# Altium project SoldeerStation.PrjPcb
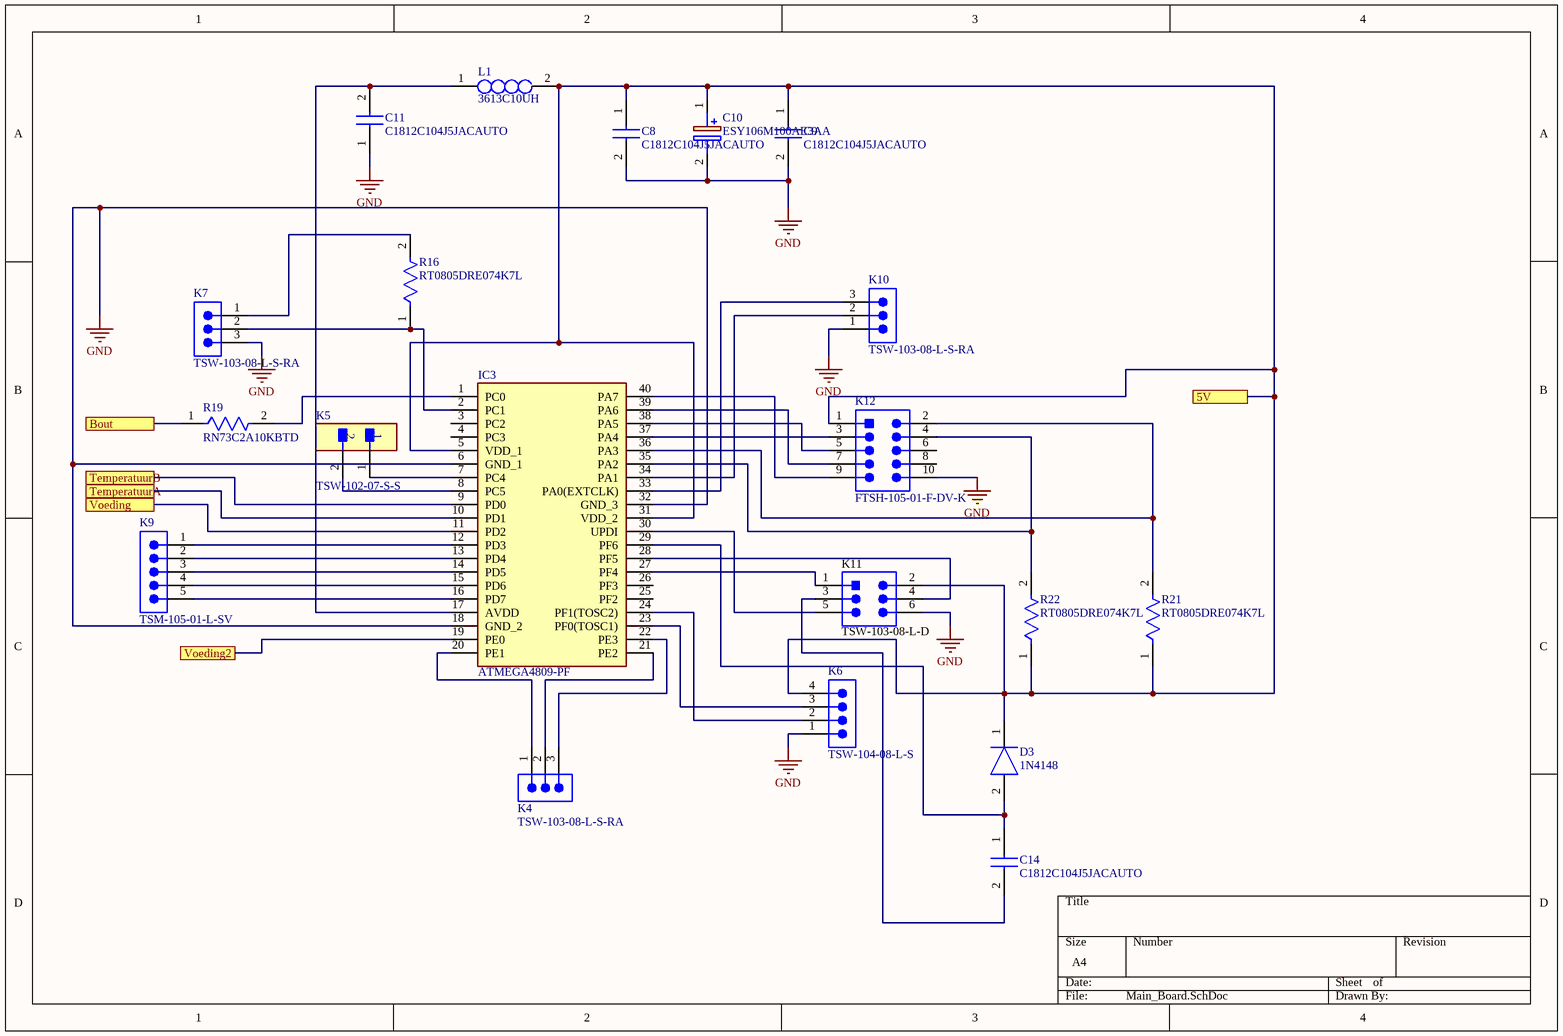
[diagram p0: Main_Board.SchDoc]
4 sheets, 76 parts. Net scope: flat (ports and power ports of the same name join across sheets).
Board file: PCBSoldeerStation.PcbDoc
Sheets:
  Main_Board.SchDoc
  Display.SchDoc
  Sturing_Temperatuur_Bout.SchDoc
  Voeding.SchDoc

## Sheet Main_Board.SchDoc
size A4; SheetNumber: 1; SheetTotal: 4

### Parts
C8  C1812C104J5JACAUTO  [CAPC4532X110N]
C9  C1812C104J5JACAUTO  [CAPC4532X110N]
C10  ESY106M100AE3AA  [CAPPRD250W50D630H1250]
C11  C1812C104J5JACAUTO  [CAPC4532X110N]
C14  C1812C104J5JACAUTO  [CAPC4532X110N]
D3  1N4148  [DIOAD1165W56L425D185]
IC3  ATMEGA4809-PF  [DIP1543W58P254L5175H635Q40N]
K4  TSW-103-08-L-S-RA  [SMTC-TSW-103-08-X-S-RA]
K5  TSW-102-07-S-S  [FP-TSW-102-07-S-S-MFG]
K6  TSW-104-08-L-S  [SMTC-TSW-104-08-X-S]
K7  TSW-103-08-L-S-RA  [SMTC-TSW-103-08-X-S-RA]
K9  TSM-105-01-L-SV  [SMTC-TSM-105-01-X-SV]
K10  TSW-103-08-L-S-RA  [SMTC-TSW-103-08-X-S-RA]
K11  TSW-103-08-L-D  [SMTC-TSW-103-08-L-D_V]
K12  FTSH-105-01-F-DV-K  [SMTC-FTSH-105-01-L-DV-K_V]
L1  3613C10UH  [INDM4532X340N]
R16  RT0805DRE074K7L  [FP-RT0805-MFG]
R19  RN73C2A10KBTD  [FP-RN732A-MFG]
R21  RT0805DRE074K7L  [FP-RT0805-MFG]
R22  RT0805DRE074K7L  [FP-RT0805-MFG]

### Ports
5V, Bout, TemperatuurA, TemperatuurB, Voeding, Voeding2

### Nets
GND: C8.2 C9.2 C10.2(-) C11.1 IC3.6(GND_1) IC3.18(GND_2) IC3.32(GND_3) K6.1 K7.3 K10.1 K11.6 K12.10
NetC2_1: C8.1 C9.1 C10.1(+) D3.1(K) IC3.5(VDD_1) IC3.31(VDD_2) K6.4 K11.2 K12.1 L1.2 R21.1 R22.1 ; port 5V
NetC6_1: IC3.9(PD0) ; port TemperatuurB
NetC11_2: C11.2 IC3.17(AVDD) L1.1
NetC12_2: IC3.10(PD1) ; port TemperatuurA
NetC14_1: C14.1 D3.2(A) IC3.29(PF6)
NetC14_2: C14.2 K11.3
NetD2_1: IC3.11(PD2) ; port Voeding
NetIC3_1: IC3.1(PC0) R19.2
NetIC3_2: IC3.2(PC1) K7.2 R16.1
NetIC3_7: IC3.7(PC4) K5.1
NetIC3_8: IC3.8(PC5) K5.2
NetIC3_12: IC3.12(PD3) K9.1
NetIC3_13: IC3.13(PD4) K9.2
NetIC3_14: IC3.14(PD5) K9.3
NetIC3_15: IC3.15(PD6) K9.4
NetIC3_16: IC3.16(PD7) K9.5
NetIC3_19: IC3.19(PE0) ; port Voeding2
NetIC3_20: IC3.20(PE1) K4.1
NetIC3_21: IC3.21(PE2) K4.2
NetIC3_22: IC3.22(PE3) K4.3
NetIC3_23: IC3.23(PF0(TOSC1)) K6.3
NetIC3_24: IC3.24(PF1(TOSC2)) K6.2
NetIC3_27: IC3.27(PF4) K11.1
NetIC3_28: IC3.28(PF5) K11.4
NetIC3_30: IC3.30(UPDI) K11.5
NetIC3_33: IC3.33(PA0(EXTCLK)) K10.3
NetIC3_34: IC3.34(PA1) K10.2
NetIC3_35: IC3.35(PA2) K12.4 R22.2
NetIC3_36: IC3.36(PA3) K12.2 R21.2
NetIC3_37: IC3.37(PA4) K12.3
NetIC3_38: IC3.38(PA5) K12.5
NetIC3_39: IC3.39(PA6) K12.7
NetIC3_40: IC3.40(PA7) K12.9
NetK7_1: K7.1 R16.2
NetR19_1: R19.1 ; port Bout

Not connected (* = marked no-connect by the designer): IC3 3(PC2) 4(PC3) 25(PF2) 26(PF3); K12 6 8

### Library data of the parts
C8 C9 C11 C14 = C1812C104J5JACAUTO: Capacitor; Manufacturer_Name: Kemet; Datasheet Link: https://www.mouser.co.uk/ProductDetail/KEMET/C1812C104J5JACAUTO?qs=sGAEpiMZZMuMW9TJLBQkXk76meUxNvf1WfCyyeF%2F6yU%3D; Height: 1.1mm; Manufacturer_Part_Number: C1812C104J5JACAUTO
C10 = ESY106M100AE3AA: Capacitor Polarised; Manufacturer_Name: Kemet; Datasheet Link: https://connect.kemet.com:7667/gateway/IntelliData-ComponentDocumentation/1.0/download/specsheet/ESY106M100AE3AA; Height: 12.5mm; Manufacturer_Part_Number: ESY106M100AE3AA
D3 = 1N4148: Diode; Manufacturer_Name: Nexperia; Datasheet Link: https://datasheet.datasheetarchive.com/originals/distributors/Datasheets-112/DSAP0040891.pdf; Manufacturer_Part_Number: 1N4148
IC3 = ATMEGA4809-PF: Integrated Circuit; Manufacturer_Name: Microchip; Datasheet Link: https://componentsearchengine.com//ATMEGA4809-PF.pdf; Height: 6.35mm; Mouser2 Part Number: 556-ATMEGA4809-PF; Mouser2 Price/Stock: https://www.mouser.com/Search/Refine.aspx?Keyword=556-ATMEGA4809-PF; Manufacturer_Part_Number: ATMEGA4809-PF
K4 K7 K10 = CMP-1024-00343-1: 0.025" SQ Post Header, Through-hole, Right Angle, -55 to 125 degC, 2.54 mm Pitch, 3-Pin, Male, RoHS; Manufacturer: Samtec; Pitch: 2.54 mm; ComponentLink2Description: Datasheet; Temperature Range: -55 to 125 degC; ComponentLink1Description: Manufacturer URL; Mounting Technology: Through-hole; ComponentLink3URL: http://www.samtec.com/documents/webfiles/cpdf/TSW-XXX-XX-XXX-X-XX-XXX-MKT.pdf; DatasheetVersion: F-214; PackageDescription: .025[0.64] SQ. Post Terminal Strip Assembly; PackageVersion: DM, 8/1988; Orientation: Right Angle; PackageReference: TSW-103-08-X-S-RA; ComponentLink1URL: http://www.samtec.com; ComponentLink3Description: Package Specification; PartNumber: TSW-103-08-L-S-RA; RoHS: True; ComponentLink2URL: http://www.samtec.com/documents/webfiles/pdf/TSW_TH.PDF
K5 = CMP-1681-00004-5: CONN HEADER VERT 2POS 2.54MM; Gender: Male; Max Current Rating: 7.6A; Max Voltage Rating (AC): 550V; Number of Contacts: 2; Contact Material: Bronze; Max Operating Temperature: 125°C; Min Operating Temperature: -55°C; Packaging: Bulk; Contact Plating: Gold; Length: 5.08mm; Mount: Through Hole; REACH SVHC: No SVHC; Package Quantity: 1; Color: Black; Connector Type: Header; Contact Finish - Mating: GOLD; Contact Mating Length: 0.23inch; Contact Shape: Square; Contact Type: Male Pin; Depth: 2.54mm; Fastening Type: Pull; Flammability Rating: UL94 V-0; Housing Color: Black; Housing Material: Polyester; Insulation Color: Black; Insulation Material: PBT; Lead Free: Lead Free; Number of Positions: 2; Number of Rows: 1; Orientation: Straight; Pitch: 2.54mm; Radiation Hardening: No; RoHS Compliant: Yes; Series: TSW; Termination: Solder; Width: 2.54mm
K6 = CMP-1024-00358-1: 0.025" SQ Post Header, Through-hole, Vertical, -55 to 125 degC, 2.54 mm Pitch, 4-Pin, Male, RoHS; Manufacturer: Samtec; Pitch: 2.54 mm; PartNumber: TSW-104-08-L-S; RoHS: True; Temperature Range: -55 to 125 degC; PackageDescription: .025[0.64] SQ. Post Terminal Strip Assembly; Orientation: Vertical; ComponentLink2URL: http://www.samtec.com/documents/webfiles/pdf/TSW_TH.PDF; ComponentLink1Description: Manufacturer URL; ComponentLink2Description: Datasheet; PackageVersion: DM, 8/1988; ComponentLink3URL: http://www.samtec.com/documents/webfiles/cpdf/TSW-XXX-XX-XXX-X-XX-XXX-MKT.pdf; Mounting Technology: Through-hole; PackageReference: TSW-104-08-X-S; ComponentLink3Description: Package Specification; ComponentLink1URL: http://www.samtec.com; DatasheetVersion: F-214
K9 = CMP-1024-00241-1: 0.025" SQ Post Header, Surface Mount, Vertical, -55 to 125 degC, 2.54 mm Pitch, 5-Pin, Male, RoHS; Manufacturer: Samtec; Pitch: 2.54 mm; Temperature Range: -55 to 125 degC; ComponentLink3Description: Package Specification; ComponentLink1Description: Manufacturer URL; RoHS: True; PackageDescription: Single Row .100 SMT Assembly; PackageReference: TSM-105-01-X-SV; PartNumber: TSM-105-01-L-SV; ComponentLink1URL: http://www.samtec.com; ComponentLink2URL: http://www.samtec.com/documents/webfiles/pdf/TSM.PDF; Orientation: Vertical; PackageVersion: BP, 8/2002; ComponentLink3URL: http://www.samtec.com/documents/webfiles/cpdf/TSM-1XX-XX-XXX-SV-XX-XXX-XX-MKT.pdf; ComponentLink2Description: Datasheet; DatasheetVersion: F-214; Mounting Technology: Surface Mount
K11 = CMP-1024-00336-5: Male Header, Pitch 2.54 mm, 2 x 3 Position, Height 8.38 mm, Tail Length 5.08 mm, -55 to 125 degC, RoHS, Bulk; Manufacturer: Samtec; DatasheetVersion: 04/2012; ComponentLink3URL: http://suddendocs.samtec.com/prints/tsw-xxx-xx-x-x-xx-xxx-footprint.pdf; PackageReference: TSW-103-08-L-D; Mounting Technology: Through Hole; Min Operating Temperature: -55 degC; ComponentLink2Description: Datasheet; Lead Pitch: 2.54 mm; ComponentLink1Description: Manufacturer URL; Mount: Through Hole; ComponentLink1URL: http://www.samtec.com/; ComponentLink3Description: Package Specification; Max Operating Temperature: 125 degC; PackageDescription: Male Header, Pitch 2.54 mm, 2 x 3 Position, Height 8.38 mm, Tail Length 5.08 mm; ComponentLink2URL: https://datasheet.ciiva.com/25618/0900766b81154476-25618436.pdf; RoHSCompliant: true
K12 = CMP-2000-05352-1: Male Header, Pitch 1.27 mm, 2 x 5 Position, Height 6.12 mm, RoHS, Tube; Manufacturer: Samtec; Number of Positions: 10; Connector Type: Header,Shrouded; Number of Positions Loaded: All; Row Spacing: 0.050"(1.27mm); Fastening Type: -; Package Reference: FTSH-105-01-L-DV-K; Termination: Solder; Package URL: http://suddendocs.samtec.com/prints/ftsh-1xx-xx-xxx-dv-xxx-footprint.pdf; Number of Rows: 2; Contact Finish Thickness: 3µin(0.08µm); Contact Type: MalePin; Manufacturer URL: http://www.samtec.com/; Contact Mating Length: 0.120"(3.05mm); Pitch: 0.050"(1.27mm); Series: FTSH; Features: -; Contact Finish: Gold; Color: Black; Family: RectangularConnectors-Headers,MalePins; Datasheet URL: http://suddendocs.samtec.com/prints/ftsh-1xx-xx-xxx-dv-xxx-mkt.pdf; Package Description: Male Header, Pitch 1.27 mm, 2 x 5 Position, Height 5.97 mm, Tail Length 4.32 mm; Mounting Type: SurfaceMount; Datasheet Version: Rev. ET, 10/1995; Category: Connectors,Interconnects; Packaging: Tube
L1 = 3613C10UH: Inductor; Manufacturer_Name: TE Connectivity; Datasheet Link: https://www.mouser.mx/datasheet/2/418/NG_CD_1624094_BB1-686728.pdf; Height: 3.4mm; Manufacturer_Part_Number: 3613C10UH
R16 R21 R22 = CMP-03412-005354-1: RES SMD 4.7K OHM 0.5% 1/8W 0805; Manufacturer: Yageo; Value: 4.7KΩ; Power Rating: 0.125W; Tolerance: 0.01; Voltage Rating: 150V; Temperature Coefficient: 50 ppm/°C; Lead Free: Yes; Device Class L2: Resistors; ComponentLink2Description: Datasheet; RoHS: TRUE; Package: RT0805; Resistance: 4.7KΩ; Device Class L3: Chip SMD Resistors; Ipc Land Pattern Name: RESC200125X50; Category: Res; Octopart: https://octopart.com/rt0805dre074k7l-yageo-1242027; Temperature: -55°C to +155°C; Temperature Range High: +155°C; Digikey Description: RES SMD 4.7K OHM 0.5% 1/8W 0805; Series: RT; Height: 0.6mm; Footprint Url: http://www.yageo.com/exep/pages/download/literatures/PYu-R_Mount_10.pdf; Device Class L1: Passive Components; Temperature Range Low: -55°C; Composition: Thin Film; Manufacturer Part Number: RT0805DRE074K7L; ComponentLink2URL: http://www.yageo.com/documents/recent/PYu-RT_1-to-0.01_RoHS_L_9.pdf; Automotive: No
R19 = CMP-03211-006013-1: SMD Chip Resistor, Thin Film, 10KΩ, 100 V, 0805 [2012 Metric], 100 mW, 0.1%, RN73 Series; Manufacturer: TE Connectivity; Voltage Rating: 100V; Power Rating: 0.1W; Temperature Coefficient: 10ppm/°C; Value: 10KΩ; Lead Free: Yes; Temperature Range Low: -55°C; Temperature: -55°C to 155°C; RoHS: TRUE; Category: Res; Device Class L3: Chip SMD Resistors; Device Class L1: Passive Components; Resistance: 10KΩ; ComponentLink2URL: https://www.te.com/commerce/DocumentDelivery/DDEController?Action=showdoc&DocId=Data+Sheet%7F1773270%7FP%7Fpdf%7FEnglish%7FENG_DS_1773270_P.pdf%7F1676162-2; Device Class L2: Resistors; Ipc Land Pattern Name: RESC200125X55; Automotive: No; Temperature Range High: 155°C; Height: 0.65mm; octopart_url: https://octopart.com/rn73c2a10kbtd-te+connectivity-22737006; Package: RN732A; Composition: Thin Film; packaging: 5000 Reel; Series: RN73; Manufacturer Part Number: RN73C2A10KBTD; ComponentLink2Description: Datasheet; Octopart: https://octopart.com/rn73c2a10kbtd-te+connectivity-22737006; Tolerance: 0.1%

## Sheet Display.SchDoc
size A4; SheetNumber: 2; SheetTotal: 4
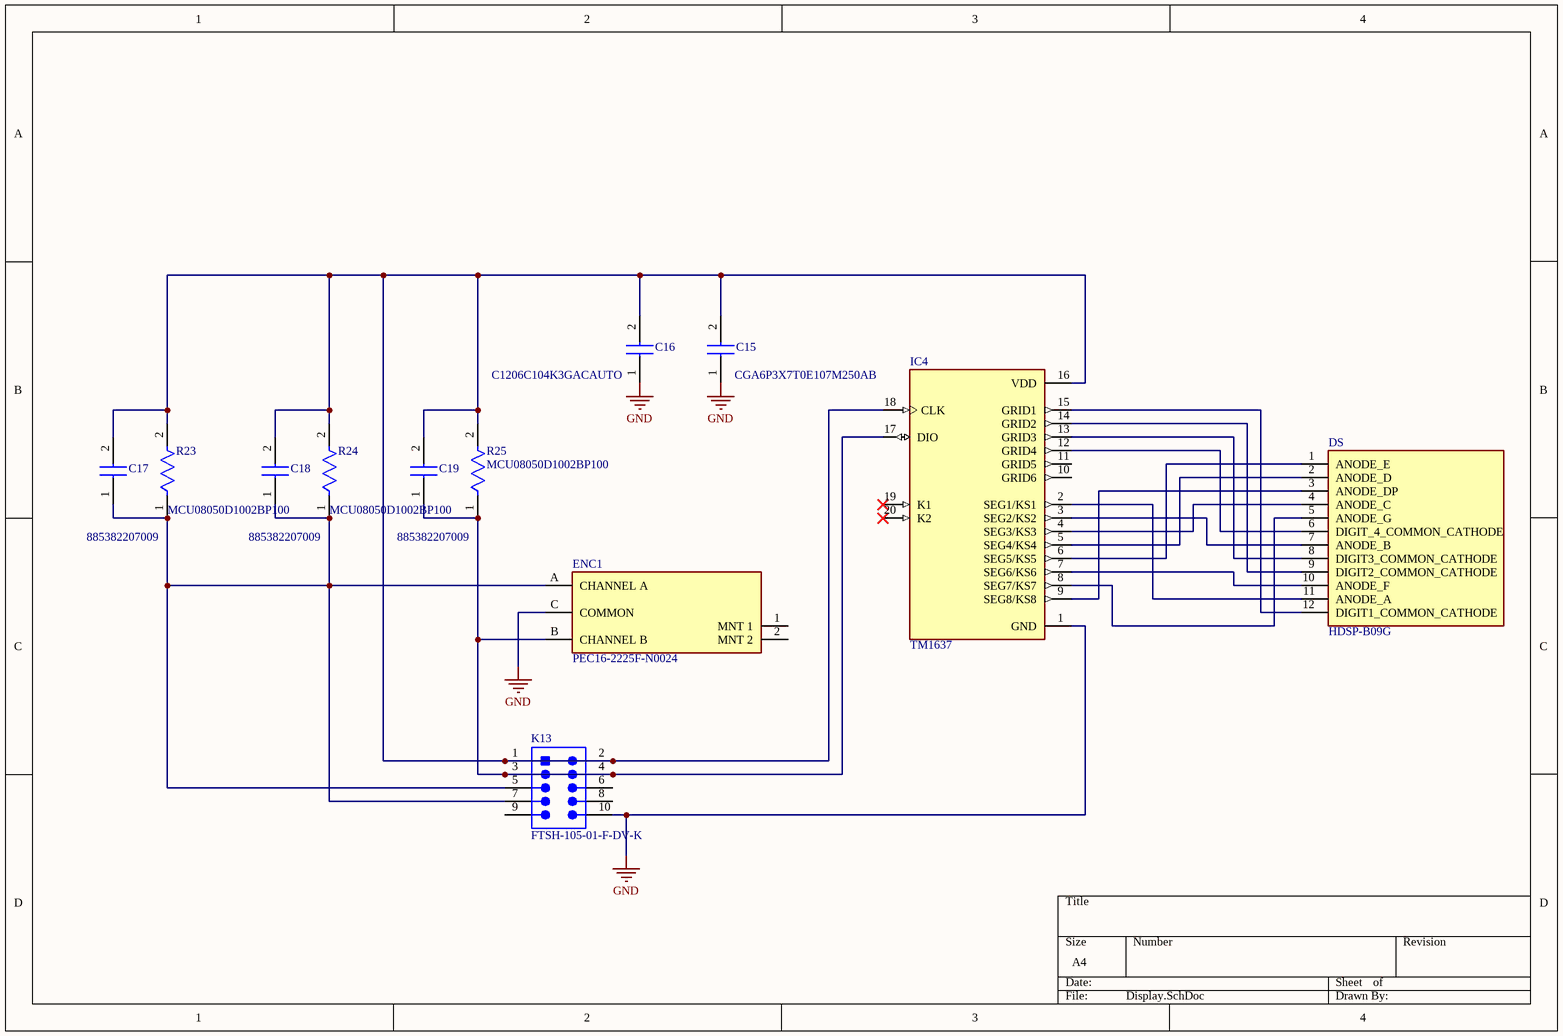
[diagram p1: Display.SchDoc]

### Parts
C15  CGA6P3X7T0E107M250AB  [CAPC3225X280N]
C16  C1206C104K3GACAUTO  [CAPC3216X180N]
C17  885382207009  [CAPC2012X135N]
C18  885382207009  [CAPC2012X135N]
C19  885382207009  [CAPC2012X135N]
DS  HDSP-B09G  [AVAGO_HDSP-B09G]
ENC1  PEC16-2225F-N0024  [FP-PEC16-2225F-N0024-MFG]
IC4  TM1637  [DIP778W43P254L2612H431Q20N]
K13  FTSH-105-01-F-DV-K  [SMTC-FTSH-105-01-L-DV-K_V]
R23  MCU08050D1002BP100  [FP-MCU0805-IPC_C]
R24  MCU08050D1002BP100  [FP-MCU0805-IPC_C]
R25  MCU08050D1002BP100  [FP-MCU0805-IPC_C]

### Nets
GND: C15.1 C16.1 ENC1.C(COMMON) IC4.1(GND) K13.10
NetC15_2: C15.2 C16.2 C17.2 C18.2 C19.2 IC4.16(VDD) IC4.18(CLK) K13.1 K13.2 R23.2 R24.2 R25.2
NetC17_1: C17.1 C18.1 ENC1.A(CHANNEL_A) K13.5 K13.7 R23.1 R24.1
NetC19_1: C19.1 ENC1.B(CHANNEL_B) IC4.17(DIO) K13.3 K13.4 R25.1
NetDS_1: DS.1(ANODE_E) IC4.6(SEG5/KS5)
NetDS_2: DS.2(ANODE_D) IC4.5(SEG4/KS4)
NetDS_3: DS.3(ANODE_DP) IC4.9(SEG8/KS8)
NetDS_4: DS.4(ANODE_C) IC4.4(SEG3/KS3)
NetDS_5: DS.5(ANODE_G) IC4.8(SEG7/KS7)
NetDS_6: DS.6(DIGIT_4_COMMON_CATHODE) IC4.12(GRID4)
NetDS_7: DS.7(ANODE_B) IC4.3(SEG2/KS2)
NetDS_8: DS.8(DIGIT3_COMMON_CATHODE) IC4.13(GRID3)
NetDS_9: DS.9(DIGIT2_COMMON_CATHODE) IC4.14(GRID2)
NetDS_10: DS.10(ANODE_F) IC4.7(SEG6/KS6)
NetDS_11: DS.11(ANODE_A) IC4.2(SEG1/KS1)
NetDS_12: DS.12(DIGIT1_COMMON_CATHODE) IC4.15(GRID1)

Not connected (* = marked no-connect by the designer): ENC1 1(MNT_1) 2(MNT_2); IC4 10(GRID6) 11(GRID5) 19(K1)* 20(K2)*; K13 6 8 9

### Library data of the parts
C15 = CGA6P3X7T0E107M250AB: Capacitor; Manufacturer_Name: TDK; Datasheet Link: https://product.tdk.com/system/files/dam/doc/product/capacitor/ceramic/mlcc/catalog/mlcc_automotive_general_en.pdf; Height: 2.8mm; Manufacturer_Part_Number: CGA6P3X7T0E107M250AB
C16 = C1206C104K3GACAUTO: Capacitor; Manufacturer_Name: Kemet; Datasheet Link: https://www.kemet.com/specsheet/C1206C104K3GACAUTO; Height: 1.8mm; Manufacturer_Part_Number: C1206C104K3GACAUTO
C17-C19 = 885382207009: Capacitor; Manufacturer_Name: Wurth Elektronik; Datasheet Link: https://katalog.we-online.com/pbs/datasheet/885382207009.pdf; Height: 1.35mm; Manufacturer_Part_Number: 885382207009
DS = HDSP-B09G: Display Modules - LED Character and Numeric Green 7-Segment Clock 4 Character Common Cathode 2.2V 20mA 0.752 H x 2.016 W x 0.315 D _19.10mm x 51.20mm x 8.00mm_ 12-DIP _0.600, 15.24mm_; MF: Broadcom Limited; Package: DIP-12 Broadcom; MP: HDSP-B09G; Value: *; Availability: Unavailable; SnapEDA_Link: https://www.snapeda.com/parts/HDSP-B09G/Broadcom%20Limited/view-part/1797524/?ref=snap; Price: None
ENC1 = CMP-07421-000055-1: ROTARY ENCODER MECHANICAL 24PPR; Operating Supply Voltage: 5V; Built in Switch: No; Output Type: Quadrature; Pulses per Revolution: 24; Number of Channels: 2; Detent: Yes; Min Operating Temperature: -30°C; Package Quantity: 50; Type: Mechanical; Number of Pins: 3; Packaging: Bulk; Max Operating Temperature: 70°C; Series: PEC16; Mount: Through Hole; Encoder Type: Mechanical; RoHS Compliant: Yes; Termination: PC Pin; Orientation: Right Angle
IC4 = TM1637: LED Drive Control Special Circuit; MF: Titan Micro Electronics; Package: Package; Availability: Not in stock; SnapEDA_Link: https://www.snapeda.com/parts/TM1637/Titan+Micro+Electronics/view-part/?ref=snap; MP: TM1637; Check_prices: https://www.snapeda.com/parts/TM1637/Titan+Micro+Electronics/view-part/?ref=eda; Value: *; Price: None
K13 = CMP-2000-05352-1: as K12 on sheet Main_Board; Fastening Type: -; Package Reference: FTSH-105-01-L-DV-K; Termination: Solder; Package URL: http://suddendocs.samtec.com/prints/ftsh-1xx-xx-xxx-dv-xxx-footprint.pdf; Number of Rows: 2; Contact Finish Thickness: 3µin(0.08µm); Contact Type: MalePin; Manufacturer URL: http://www.samtec.com/; Contact Mating Length: 0.120"(3.05mm); Pitch: 0.050"(1.27mm); Series: FTSH; Features: -; Contact Finish: Gold; Color: Black; Family: RectangularConnectors-Headers,MalePins; Datasheet URL: http://suddendocs.samtec.com/prints/ftsh-1xx-xx-xxx-dv-xxx-mkt.pdf; Package Description: Male Header, Pitch 1.27 mm, 2 x 5 Position, Height 5.97 mm, Tail Length 4.32 mm; Mounting Type: SurfaceMount; Datasheet Version: Rev. ET, 10/1995; Category: Connectors,Interconnects; Packaging: Tube
R23-R25 = CMP-02407-010458-1: RES 1.05K OHM 0.5% 1/5W 0805; Power Rating: 125mW; Voltage Rating (DC): 100V; Tolerance: 0.1%; Resistance: 10kR; Temperature Coefficient: 25ppm/°C; Min Operating Temperature: -55°C; Military Standard: Not; Composition: Thin Film; Max Power Dissipation: 125mW; Lead Free: Lead Free; Case/Package: 0805; Contact Plating: Tin; Depth: 1.25mm; Number of Terminations: 2; Height: 0.022inch; Package Quantity: 1000; Max Operating Temperature: 125°C; Packaging: Tape and Reel; Mount: Surface Mount; Radiation Hardening: No; Length: 2mm; Width: 0.049inch

## Sheet Sturing_Temperatuur_Bout.SchDoc
size A4; SheetNumber: 3; SheetTotal: 4
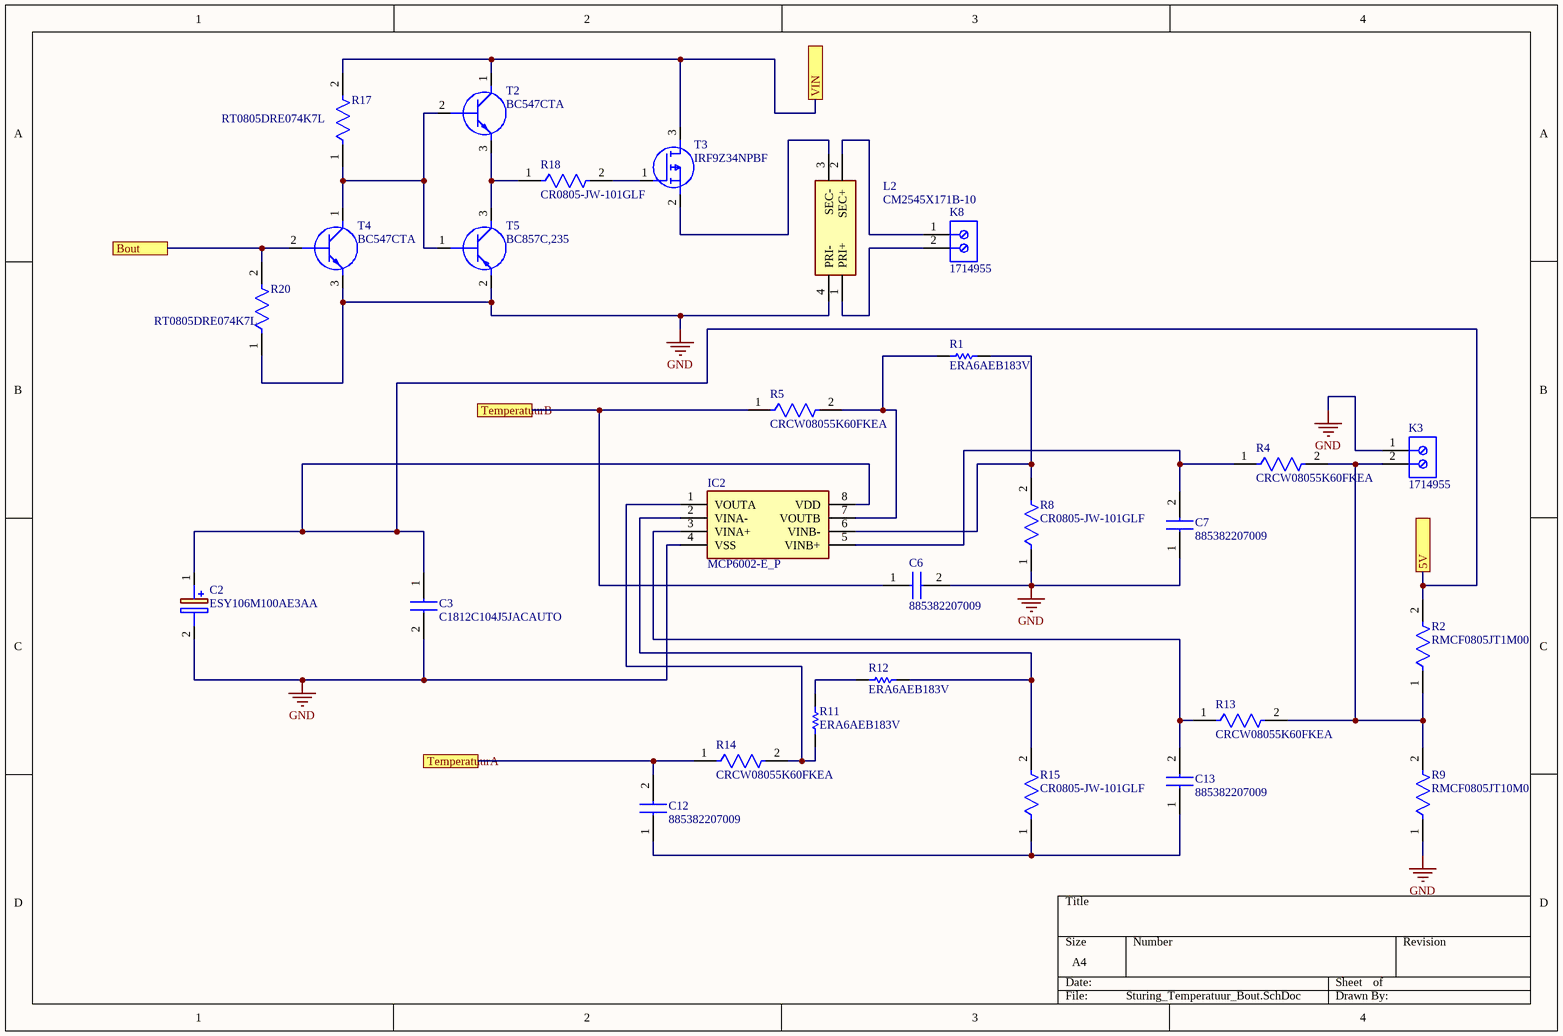
[diagram p2: Sturing_Temperatuur_Bout.SchDoc]

### Parts
C2  ESY106M100AE3AA  [CAPPRD250W50D630H1250]
C3  C1812C104J5JACAUTO  [CAPC4532X110N]
C6  885382207009  [CAPC2012X135N]
C7  885382207009  [CAPC2012X135N]
C12  885382207009  [CAPC2012X135N]
C13  885382207009  [CAPC2012X135N]
IC2  MCP6002-E_P  [DIP781W56P254L950H533Q8N]
K3  1714955  [PHOE-1714955_V]
K8  1714955  [PHOE-1714955_V]
L2  CM2545X171B-10  [CM2545X171B10]
R1  ERA6AEB183V  [RESC2013X60X40LL20T25]
R2  RMCF0805JT1M00  [FP-RMCF0805-IPC_C]
R4  CRCW08055K60FKEA  [FP-CRCW0805-e3-IPC_A]
R5  CRCW08055K60FKEA  [FP-CRCW0805-e3-IPC_A]
R8  CR0805-JW-101GLF  [FP-CR0805-IPC_A]
R9  RMCF0805JT10M0  [FP-RMCF0805-IPC_A]
R11  ERA6AEB183V  [RESC2013X60X40LL20T25]
R12  ERA6AEB183V  [RESC2013X60X40LL20T25]
R13  CRCW08055K60FKEA  [FP-CRCW0805-e3-IPC_A]
R14  CRCW08055K60FKEA  [FP-CRCW0805-e3-IPC_A]
R15  CR0805-JW-101GLF  [FP-CR0805-IPC_A]
R17  RT0805DRE074K7L  [FP-RT0805-MFG]
R18  CR0805-JW-101GLF  [FP-CR0805-IPC_A]
R20  RT0805DRE074K7L  [FP-RT0805-MFG]
T2  BC547CTA  [MC79L15ACPG]
T3  IRF9Z34NPBF  [TO254P469X1042X1967-3P]
T4  BC547CTA  [MC79L15ACPG]
T5  BC857C,235  [SOT95P230X110-3N]

### Ports
5V, Bout, TemperatuurA, TemperatuurB, VIN

### Nets
GND: C2.2(-) C3.2 C6.2 C7.1 IC2.4(VSS) K3.1 L2.4(PRI-) R8.1 R9.1 R20.1 T4.3(E) T5.2(E)
NetB1_1: R17.2 T2.1(C) T3.3(D) ; port VIN
NetC2_1: C2.1(+) C3.1 IC2.8(VDD) R2.2 ; port 5V
NetC6_1: C6.1 R5.1 ; port TemperatuurB
NetC7_2: C7.2 IC2.5(VINB+) R4.1
NetC12_1: C12.1 C13.1 R15.1
NetC12_2: C12.2 R14.1 ; port TemperatuurA
NetC13_2: C13.2 IC2.3(VINA+) R13.1
NetIC2_1: IC2.1(VOUTA) R11.1 R14.2
NetIC2_2: IC2.2(VINA-) R12.2 R15.2
NetIC2_6: IC2.6(VINB-) R1.2 R8.2
NetIC2_7: IC2.7(VOUTB) R1.1 R5.2
NetK3_2: K3.2 R2.1 R4.2 R9.2 R13.2
NetK8_1: K8.1 L2.2(SEC+)
NetK8_2: K8.2 L2.1(PRI+)
NetL2_3: L2.3(SEC-) T3.2(S)
NetR11_2: R11.2 R12.1
NetR17_1: R17.1 T2.2(B) T4.1(C) T5.1(B)
NetR18_1: R18.1 T2.3(E) T5.3(C)
NetR18_2: R18.2 T3.1(G)
NetR19_1: R20.2 T4.2(B) ; port Bout

### Library data of the parts
C2 = ESY106M100AE3AA: as C10 on sheet Main_Board; Datasheet Link: https://connect.kemet.com:7667/gateway/IntelliData-ComponentDocumentation/1.0/download/specsheet/ESY106M100AE3AA; Height: 12.5mm; Manufacturer_Part_Number: ESY106M100AE3AA
C3 = C1812C104J5JACAUTO: Capacitor; Manufacturer_Name: Kemet; Datasheet Link: https://www.mouser.co.uk/ProductDetail/KEMET/C1812C104J5JACAUTO?qs=sGAEpiMZZMuMW9TJLBQkXk76meUxNvf1WfCyyeF%2F6yU%3D; Height: 1.1mm; Manufacturer_Part_Number: C1812C104J5JACAUTO
C6 C7 C12 C13 = 885382207009: as C17 on sheet Display; Datasheet Link: https://katalog.we-online.com/pbs/datasheet/885382207009.pdf; Height: 1.35mm; Manufacturer_Part_Number: 885382207009
IC2 = MCP6002-E_P: Integrated Circuit; Manufacturer_Name: Microchip; Manufacturer_Part_Number: MCP6002-E/P; Datasheet Link: https://componentsearchengine.com//MCP6002-E_P.pdf; Height: 5.334mm; Mouser2 Part Number: 579-MCP6002-E/P; Mouser2 Price/Stock: https://www.mouser.com/Search/Refine.aspx?Keyword=579-MCP6002-E%2FP
K3 K8 = CMP-2000-05797-1: PC Terminal Block, Pitch 6.35 mm, 1 x 2 Position, Height 21.5 mm, Tail Lenght 5.1 mm, RoHS, Bulk; Manufacturer: Phoenix Contact; Package Description: PC Terminal Block, Pitch 6.35 mm, 1 x 2 Position, Height 21.5 mm, Tail Lenght 5.1 mm; Datasheet URL: http://media.digikey.com/pdf/Data%20Sheets/Phoenix%20Contact%20PDFs/1714955.pdf; Package Reference: 1714955; Manufacturer URL: http://www.phoenixcontact.com/; Datasheet Version: 02/2010; Mounting Technology: ThroughHole
L2 = CM2545X171B-10: Transformer; Manufacturer_Name: Laird Technologies; Datasheet Link: https://datasheet.datasheetarchive.com/originals/dk/DKDS-7/122753.pdf; Height: 9.5mm; Manufacturer_Part_Number: CM2545X171B-10
R1 R11 R12 = CMP-2001-00606-1: Manufacturer: Panasonic; Part Number: ERA6AEB183V
R2 = CMP-26527-000066-1: 1MΩ ±5% 0.125W 0805 Thick Film Chip Resistor AEC-Q200 compliant; Temperature Coefficient: 200ppm/°C; Max Power Dissipation: 125mW; Resistance: 1MR; Construction: Rectangular; Case Code (Metric): 2012; Radiation Hardening: No; Contact Plating: Tin; Military Standard: Not; Features: Automotive AEC-Q200; Resistor Type: Thick Film; Series: RMCF; Length: 2mm; Min Operating Temperature: -55°C; Case Code (Imperial): 0805; Height: 0.026inch; Mount: Surface Mount; Max Operating Temperature: 155°C; Depth: 1.25mm; Width: 0.049inch; Packaging: Tape and Reel; Number of Terminations: 2; Case/Package: 0805; Tolerance: 5%; Lead Free: Lead Free; RoHS Compliant: Yes
R4 R5 R13 R14 = CMP-2001-04030-2: RES Thick Film, 5.6kΩ, 1%, 0.125W, 100ppm/°C, 0805; Resistance: 5.6kR; Voltage Rating: 150V; Max Power Dissipation: 125mW; Case Code (Imperial): 0805; Features: Automotive AEC-Q200; Composition: Thick Film; Package Quantity: 1; Mount: Surface Mount; Tolerance: 1%; Radiation Hardening: No; Length: 2mm; Case Code (Metric): 2012; Temperature Coefficient: 100ppm/°C; Power Rating: 125mW; Number of Terminations: 2; Lead Free: Lead Free; Voltage Rating (DC): 150V; Military Standard: Not; Number of Pins: 2; Height: 0.45mm; Depth: 1.25mm; Weight: 0.000194oz; Packaging: Tape and Reel; Case/Package: 0805; Contact Plating: Tin; Min Operating Temperature: -55°C; Termination: SMD/SMT; Max Operating Temperature: 155°C; Width: 1.25mm
R8 R15 R18 = CMP-07231-005410-1: Thick Film Chip Resistors 0805 100Ω 0.125W 5% 200ppm/°C; Voltage Rating: 150V; Resistance: 100R; Max Power Dissipation: 125mW; Composition: Thick Film; Height: 0.024inch; Mount: Surface Mount; Min Operating Temperature: -55°C; Case/Package: 0805; Depth: 1.25mm; Number of Terminations: 2; Features: Moisture Resistant; Thickness: 508um; Temperature Coefficient: 200ppm/°C; Contact Plating: Tin; Length: 0.079inch; Max Operating Temperature: 155°C; Tolerance: 5%; Case Code (Metric): 2012; Width: 0.049inch; Case Code (Imperial): 0805; Power Rating: 125mW; Packaging: Tape and Reel; Termination: SMD/SMT; Package Quantity: 10000; Radiation Hardening: No; Military Standard: Not
R9 = CMP-26527-000232-1: 10MΩ ±5% 0.125W 0805 Thick Film Chip Resistor AEC-Q200 compliant; Power Rating: 125mW; Temperature Coefficient: 200ppm/°C; Resistance: 10MR; Size Code: 0805; Resistor Type: Thick Film; RoHS Compliant: Yes; Max Operating Temperature: 155°C; Width: 0.049inch; Case/Package: 0805; Military Standard: Not; Max Power Dissipation: 125mW; Length: 2mm; Min Operating Temperature: -55°C; Tolerance: 5%; Height: 0.026inch; Depth: 1.25mm; Construction: Rectangular; Mount: Surface Mount; Radiation Hardening: No; Contact Plating: Tin; Case Code (Metric): 2012; Features: Automotive AEC-Q200; Case Code (Imperial): 0805; Packaging: Tape and Reel; Number of Terminations: 2; Lead Free: Lead Free; Series: RMCF
R17 R20 = CMP-03412-005354-1: as R16 on sheet Main_Board; Lead Free: Yes; Device Class L2: Resistors; ComponentLink2Description: Datasheet; RoHS: TRUE; Package: RT0805; Resistance: 4.7KΩ; Device Class L3: Chip SMD Resistors; Ipc Land Pattern Name: RESC200125X50; Category: Res; Octopart: https://octopart.com/rt0805dre074k7l-yageo-1242027; Temperature: -55°C to +155°C; Temperature Range High: +155°C; Digikey Description: RES SMD 4.7K OHM 0.5% 1/8W 0805; Series: RT; Height: 0.6mm; Footprint Url: http://www.yageo.com/exep/pages/download/literatures/PYu-R_Mount_10.pdf; Device Class L1: Passive Components; Temperature Range Low: -55°C; Composition: Thin Film; Manufacturer Part Number: RT0805DRE074K7L; ComponentLink2URL: http://www.yageo.com/documents/recent/PYu-RT_1-to-0.01_RoHS_L_9.pdf; Automotive: No
T2 T4 = BC547CTA: Transistor BJT NPN; Manufacturer_Name: ON Semiconductor; Datasheet Link: http://www.onsemi.com/pub/Collateral/BC550-D.pdf; Manufacturer_Part_Number: BC547CTA
T3 = IRF9Z34NPBF: MOSFET (P-Channel); Manufacturer_Name: Infineon; Datasheet Link: https://componentsearchengine.com//IRF9Z34NPBF.pdf; Height: 4.69mm; Mouser2 Part Number: 942-IRF9Z34NPBF; Mouser2 Price/Stock: https://www.mouser.com/Search/Refine.aspx?Keyword=942-IRF9Z34NPBF; Manufacturer_Part_Number: IRF9Z34NPBF
T5 = BC857C,235: Transistor BJT PNP; Manufacturer_Name: Nexperia; Datasheet Link: https://componentsearchengine.com//BC857C,235.pdf; Height: 1.1mm; Mouser2 Part Number: 771-BC857C235; Mouser2 Price/Stock: https://www.mouser.com/Search/Refine.aspx?Keyword=771-BC857C235; Manufacturer_Part_Number: BC857C,235

## Sheet Voeding.SchDoc
size A4; SheetNumber: 4; SheetTotal: 4
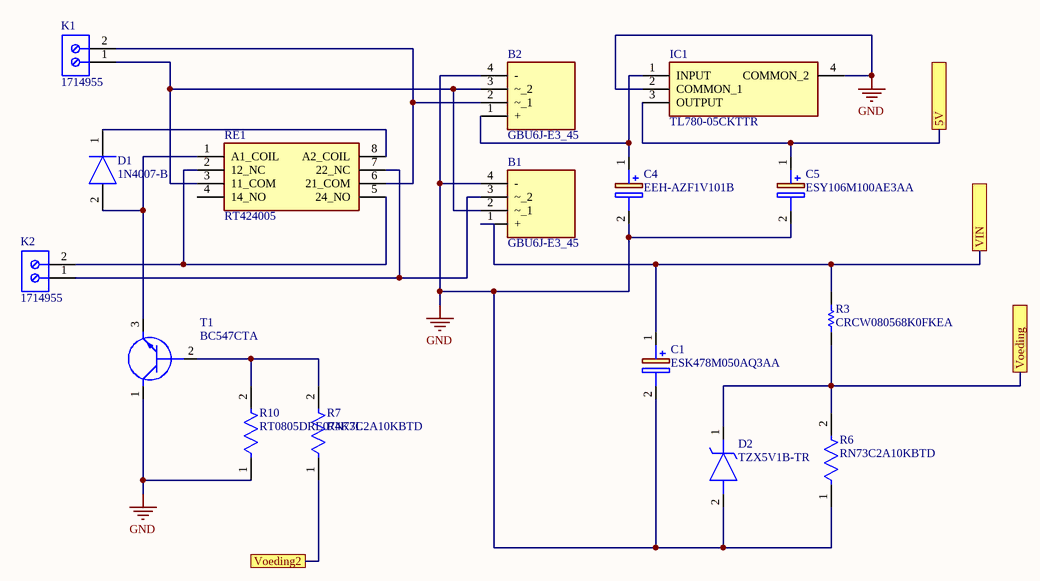
[diagram p3: Voeding.SchDoc]

### Parts
B1  GBU6J-E3_45  [GBU6JE345]
B2  GBU6J-E3_45  [GBU6JE345]
C1  ESK478M050AQ3AA  [CAPPRD1000W80D2200H3700]
C4  EEH-AZF1V101B  [CAPPRD350W65D800H1050]
C5  ESY106M100AE3AA  [CAPPRD250W50D630H1250]
D1  1N4007-B  [DIOAD1410W90L470D235]
D2  TZX5V1B-TR  [DIOAD950W60L350D150]
IC1  TL780-05CKTTR  [TL78005CKTTR]
K1  1714955  [PHOE-1714955_V]
K2  1714955  [PHOE-1714955_V]
R3  CRCW080568K0FKEA  [RESC2013X50X30ML20T20]
R6  RN73C2A10KBTD  [FP-RN732A-MFG]
R7  RN73C2A10KBTD  [FP-RN732A-MFG]
R10  RT0805DRE074K7L  [FP-RT0805-MFG]
RE1  RT424005  [RT42]
T1  BC547CTA  [MC79L15ACPG]

### Ports
5V, VIN, Voeding, Voeding2

### Nets
GND: B1.4(-) B2.4(-) C1.2(-) C4.2(-) C5.2(-) D2.2(A) IC1.2(COMMON_1) IC1.4(COMMON_2) R6.1 R10.1 T1.1(C)
NetB1_1: B1.1(+) C1.1(+) R3.2 ; port VIN
NetB1_2: B1.2(~_1) B2.3(~_2) K1.1 RE1.3(11_COM)
NetB1_3: B1.3(~_2) K2.1 RE1.7(22_NC)
NetB2_1: B2.1(+) C4.1(+) IC1.1(INPUT)
NetB2_2: B2.2(~_1) K1.2 RE1.6(21_COM)
NetC2_1: C5.1(+) IC1.3(OUTPUT) ; port 5V
NetD1_1: D1.1(K) RE1.8(A2_COIL)
NetD1_2: D1.2(A) RE1.1(A1_COIL) T1.3(E)
NetD2_1: D2.1(K) R3.1 R6.2 ; port Voeding
NetIC3_19: R7.1 ; port Voeding2
NetK2_2: K2.2 RE1.2(12_NC) RE1.5(24_NO)
NetR7_2: R7.2 R10.2 T1.2(B)

Not connected (* = marked no-connect by the designer): RE1 4(14_NO)

### Library data of the parts
B1 B2 = GBU6J-E3_45: Bridge Rectifier; Manufacturer_Name: Vishay; Manufacturer_Part_Number: GBU6J-E3/45; Datasheet Link: http://www.vishay.com/docs/88615/gbu6a.pdf; Height: 18.8mm
C1 = ESK478M050AQ3AA: Capacitor Polarised; Manufacturer_Name: Kemet; Datasheet Link: https://componentsearchengine.com//ESK478M050AQ3AA.pdf; Height: 37mm; Mouser2 Part Number: 80-ESK478M050AQ3AA; Mouser2 Price/Stock: https://www.mouser.com/Search/Refine.aspx?Keyword=80-ESK478M050AQ3AA; Manufacturer_Part_Number: ESK478M050AQ3AA
C4 = EEH-AZF1V101B: Capacitor Polarised; Manufacturer_Name: Panasonic; Datasheet Link: http://industrial.panasonic.com/cdbs/www-data/pdf/RDD0000/RDD0000C1240.pdf; Height: 10.5mm; Manufacturer_Part_Number: EEH-AZF1V101B
C5 = ESY106M100AE3AA: as C10 on sheet Main_Board; Datasheet Link: https://connect.kemet.com:7667/gateway/IntelliData-ComponentDocumentation/1.0/download/specsheet/ESY106M100AE3AA; Height: 12.5mm; Manufacturer_Part_Number: ESY106M100AE3AA
D1 = 1N4007-B: Diode; Manufacturer_Name: Rectron; Datasheet Link: https://www.arrow.com/en/products/1n4007-b/rectron; Manufacturer_Part_Number: 1N4007-B
D2 = TZX5V1B-TR: Zener Diode; Manufacturer_Name: Vishay; Datasheet Link: https://componentsearchengine.com/Datasheets/1/TZX5V1B-TR.pdf; Manufacturer_Part_Number: TZX5V1B-TR
IC1 = TL780-05CKTTR: Integrated Circuit; Manufacturer_Name: Texas Instruments; Datasheet Link: http://www.ti.com/general/docs/suppproductinfo.tsp?distId=26&gotoUrl=http%3A%2F%2Fwww.ti.com%2Flit%2Fgpn%2Ftl780; Height: 5.08mm; Manufacturer_Part_Number: TL780-05CKTTR
K1 K2 = CMP-2000-05797-1: as K3 on sheet Sturing_Temperatuur_Bout; Package Description: PC Terminal Block, Pitch 6.35 mm, 1 x 2 Position, Height 21.5 mm, Tail Lenght 5.1 mm; Datasheet URL: http://media.digikey.com/pdf/Data%20Sheets/Phoenix%20Contact%20PDFs/1714955.pdf; Package Reference: 1714955; Manufacturer URL: http://www.phoenixcontact.com/; Datasheet Version: 02/2010; Mounting Technology: ThroughHole
R3 = CMP-2001-04072-1: Manufacturer: Vishay Dale; Part Number: CRCW080568K0FKEA
R6 R7 = CMP-03211-006013-1: as R19 on sheet Main_Board; Value: 10KΩ; Lead Free: Yes; Temperature Range Low: -55°C; Temperature: -55°C to 155°C; RoHS: TRUE; Category: Res; Device Class L3: Chip SMD Resistors; Device Class L1: Passive Components; Resistance: 10KΩ; ComponentLink2URL: https://www.te.com/commerce/DocumentDelivery/DDEController?Action=showdoc&DocId=Data+Sheet%7F1773270%7FP%7Fpdf%7FEnglish%7FENG_DS_1773270_P.pdf%7F1676162-2; Device Class L2: Resistors; Ipc Land Pattern Name: RESC200125X55; Automotive: No; Temperature Range High: 155°C; Height: 0.65mm; octopart_url: https://octopart.com/rn73c2a10kbtd-te+connectivity-22737006; Package: RN732A; Composition: Thin Film; packaging: 5000 Reel; Series: RN73; Manufacturer Part Number: RN73C2A10KBTD; ComponentLink2Description: Datasheet; Octopart: https://octopart.com/rn73c2a10kbtd-te+connectivity-22737006; Tolerance: 0.1%
R10 = CMP-03412-005354-1: as R16 on sheet Main_Board; Lead Free: Yes; Device Class L2: Resistors; ComponentLink2Description: Datasheet; RoHS: TRUE; Package: RT0805; Resistance: 4.7KΩ; Device Class L3: Chip SMD Resistors; Ipc Land Pattern Name: RESC200125X50; Category: Res; Octopart: https://octopart.com/rt0805dre074k7l-yageo-1242027; Temperature: -55°C to +155°C; Temperature Range High: +155°C; Digikey Description: RES SMD 4.7K OHM 0.5% 1/8W 0805; Series: RT; Height: 0.6mm; Footprint Url: http://www.yageo.com/exep/pages/download/literatures/PYu-R_Mount_10.pdf; Device Class L1: Passive Components; Temperature Range Low: -55°C; Composition: Thin Film; Manufacturer Part Number: RT0805DRE074K7L; ComponentLink2URL: http://www.yageo.com/documents/recent/PYu-RT_1-to-0.01_RoHS_L_9.pdf; Automotive: No
RE1 = RT424005: Relay or Contactor; Manufacturer_Name: TE Connectivity; Datasheet Link: https://componentsearchengine.com//RT424005.pdf; Mouser2 Part Number: 655-RT424005; Mouser2 Price/Stock: https://www.mouser.com/Search/Refine.aspx?Keyword=655-RT424005; Manufacturer_Part_Number: RT424005
T1 = BC547CTA: as T2 on sheet Sturing_Temperatuur_Bout; Datasheet Link: http://www.onsemi.com/pub/Collateral/BC550-D.pdf; Manufacturer_Part_Number: BC547CTA

## Nets that join several sheets
GND: Main_Board (12 pins), Display (5 pins), Sturing_Temperatuur_Bout (12 pins), Voeding (11 pins)
NetB1_1: Sturing_Temperatuur_Bout (R17.2 T2.1 T3.3), Voeding (B1.1 C1.1 R3.2)
NetC2_1: Main_Board (12 pins), Sturing_Temperatuur_Bout (C2.1 C3.1 IC2.8 R2.2), Voeding (C5.1 IC1.3)
NetC6_1: Main_Board (IC3.9), Sturing_Temperatuur_Bout (C6.1 R5.1)
NetC12_2: Main_Board (IC3.10), Sturing_Temperatuur_Bout (C12.2 R14.1)
NetD2_1: Main_Board (IC3.11), Voeding (D2.1 R3.1 R6.2)
NetIC3_19: Main_Board (IC3.19), Voeding (R7.1)
NetR19_1: Main_Board (R19.1), Sturing_Temperatuur_Bout (R20.2 T4.2)